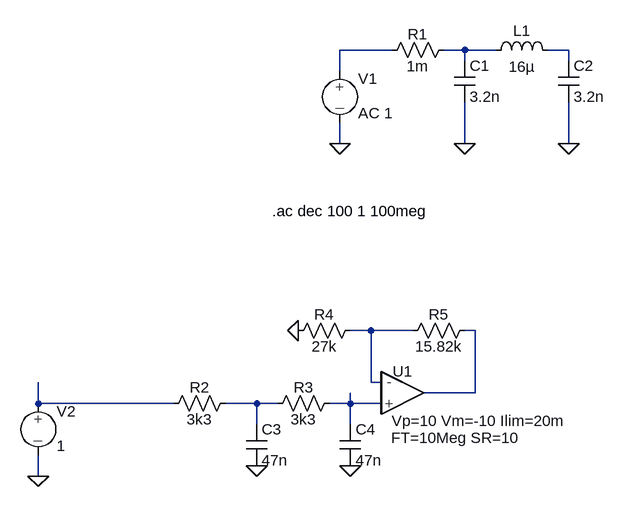
[diagram p0: schematic butterworth.asc]
butterworth.asc, the LTspice schematic file:
Version 4
SHEET 1 880 756
WIRE -160 80 -240 80
WIRE -48 80 -80 80
WIRE 0 80 -48 80
WIRE 112 80 80 80
WIRE -48 96 -48 80
WIRE 112 96 112 80
WIRE -240 112 -240 80
WIRE -240 224 -240 192
WIRE -48 224 -48 160
WIRE 112 224 112 160
WIRE -192 512 -224 512
WIRE -128 512 -192 512
WIRE -32 512 -48 512
WIRE -192 592 -192 512
WIRE -176 592 -192 592
WIRE -32 608 -32 512
WIRE -32 608 -112 608
WIRE -704 624 -704 592
WIRE -496 624 -704 624
WIRE -368 624 -416 624
WIRE -336 624 -368 624
WIRE -224 624 -224 608
WIRE -224 624 -256 624
WIRE -176 624 -224 624
WIRE -368 656 -368 624
WIRE -224 656 -224 624
WIRE -704 736 -704 704
FLAG -240 224 0
FLAG -48 224 0
FLAG 112 224 0
FLAG -304 512 0
FLAG -224 720 0
FLAG -368 720 0
FLAG -704 736 0
SYMBOL res -176 96 R270
WINDOW 0 25 56 VTop 0
WINDOW 3 7 56 VBottom 0
SYMATTR InstName R1
SYMATTR Value 1m
SYMBOL cap -64 96 R0
SYMATTR InstName C1
SYMATTR Value 3.2n
SYMBOL ind -16 96 R270
WINDOW 0 30 56 VTop 0
WINDOW 3 6 56 VBottom 0
SYMATTR InstName L1
SYMATTR Value 16µ
SYMBOL cap 96 96 R0
SYMATTR InstName C2
SYMATTR Value 3.2n
SYMBOL source-V -240 96 R0
SYMATTR InstName V1
SYMATTR Value AC 1
SYMBOL EIT_Semiconductors\\op_3 -144 608 R0
SYMATTR InstName U1
SYMBOL res -400 608 R90
WINDOW 0 7 56 VBottom 0
WINDOW 3 25 56 VTop 0
SYMATTR InstName R2
SYMATTR Value 3k3
SYMBOL res -240 608 R90
WINDOW 0 7 56 VBottom 0
WINDOW 3 25 56 VTop 0
SYMATTR InstName R3
SYMATTR Value 3k3
SYMBOL res -208 496 R90
WINDOW 0 7 56 VBottom 0
WINDOW 3 25 56 VTop 0
SYMATTR InstName R4
SYMATTR Value 27k
SYMBOL res -32 496 R90
WINDOW 0 7 56 VBottom 0
WINDOW 3 25 56 VTop 0
SYMATTR InstName R5
SYMATTR Value 15.82k
SYMBOL cap -384 656 R0
SYMATTR InstName C3
SYMATTR Value 47n
SYMBOL cap -240 656 R0
SYMATTR InstName C4
SYMATTR Value 47n
SYMBOL source-V -704 608 R0
SYMATTR InstName V2
SYMATTR Value 1
TEXT -344 328 Left 0 !.ac dec 100 1 100meg

The netlist it stands for:
* butterworth.asc
R1 N001 N002 1m
C1 N002 0 3.2n
L1 N002 N003 16µ
C2 N003 0 3.2n
V1 N001 0 AC 1
XU1 N008 N004 N005 opamp_param_3 Vp=10 Vm=-10 Ilim=20m FT=10Meg SR=10 Vos=0 A0=100k phir=45 en=0 enk=0 in=0 ink=0 Rin=500Meg  ; pins In+ In- OUT
R2 N007 N006 3k3
R3 N008 N007 3k3
R4 N004 0 27k
R5 N005 N004 15.82k
C3 N007 0 47n
C4 N008 0 47n
V2 N006 0 1
.ac dec 100 1 100meg
.lib EIT_sub\opamp_parametrierbar.sub
.backanno
.end